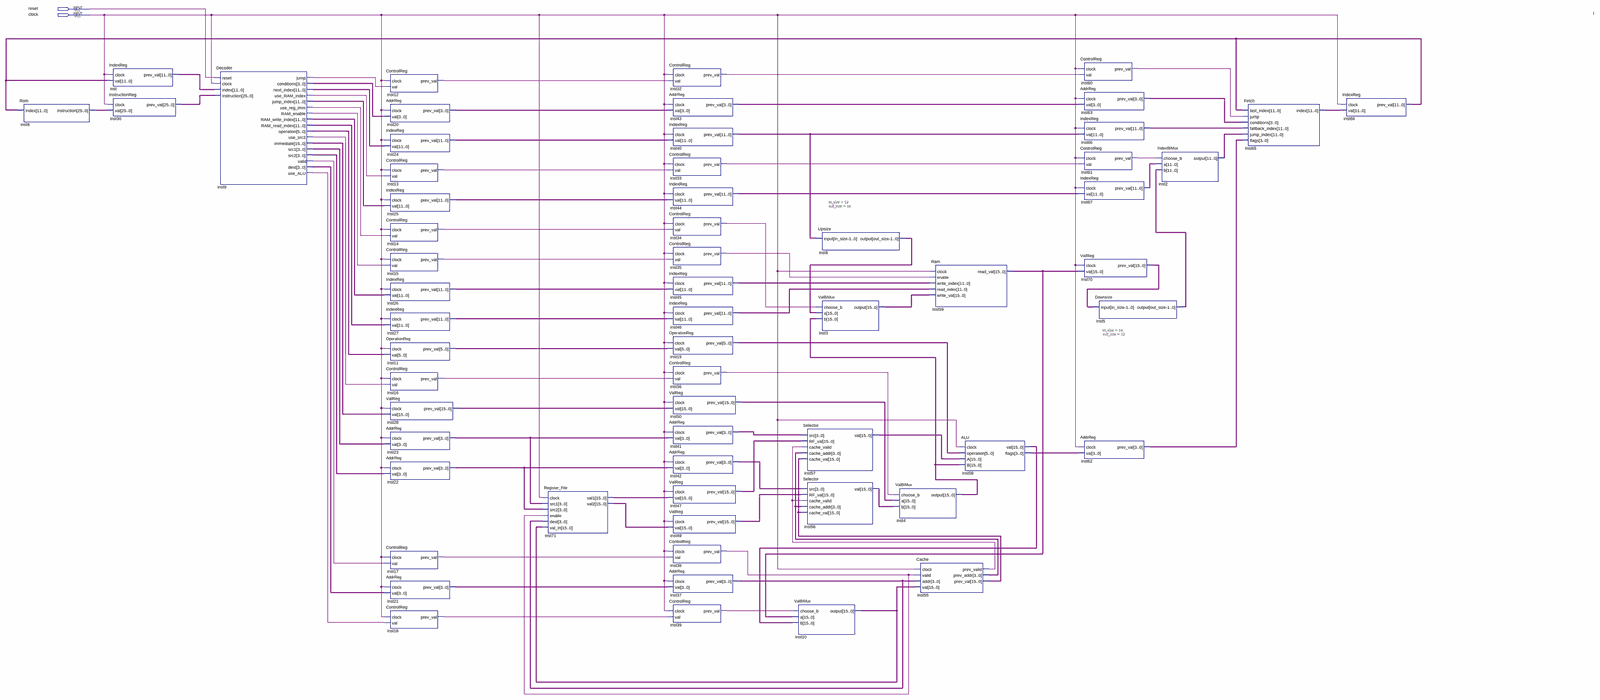
[diagram p0: schematic sheet, whole]
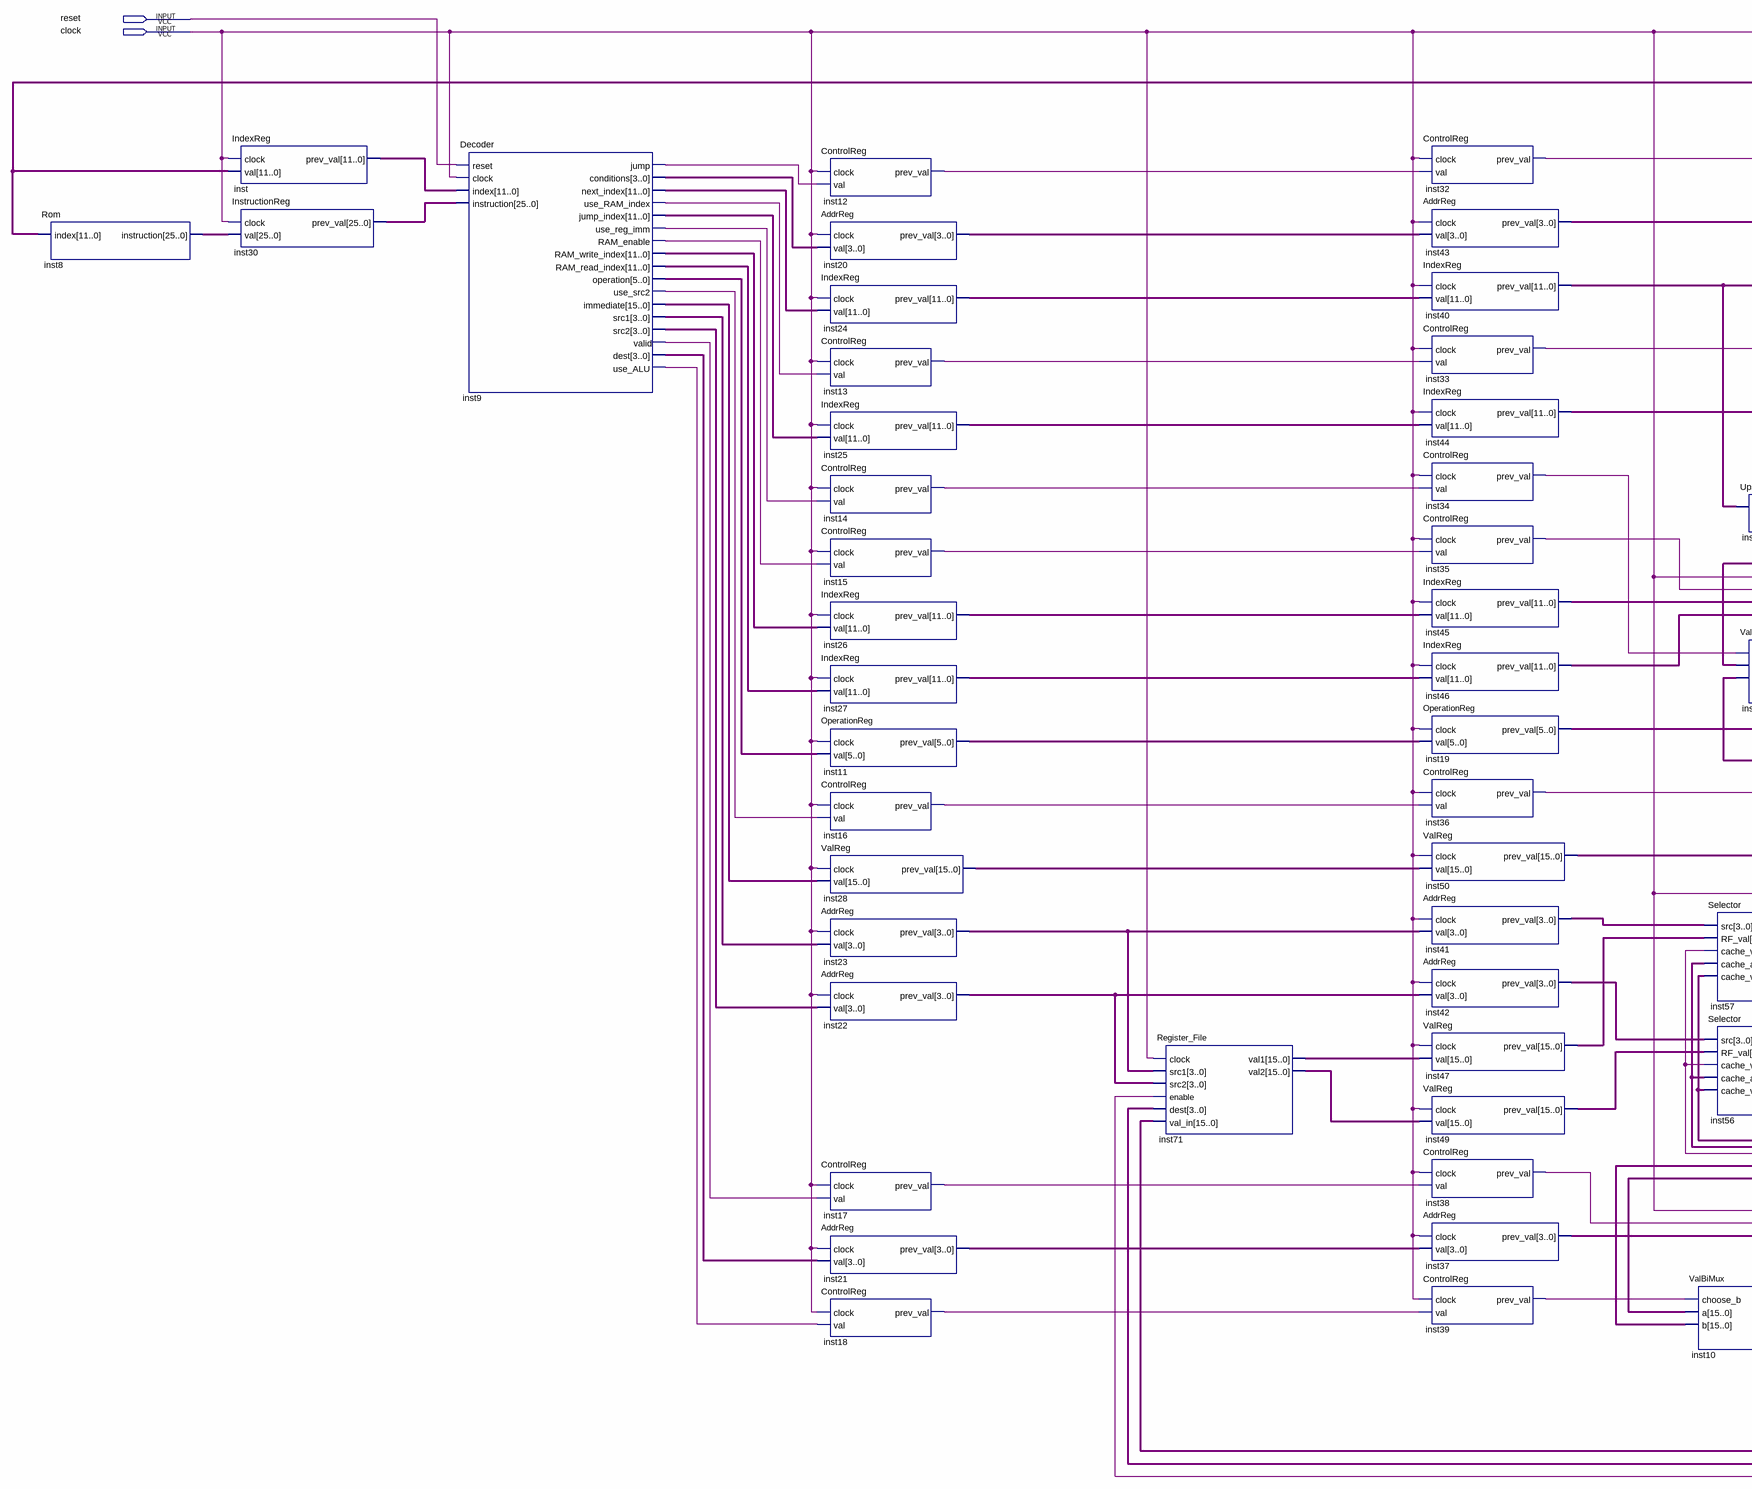
[diagram p1: schematic sheet, left part]
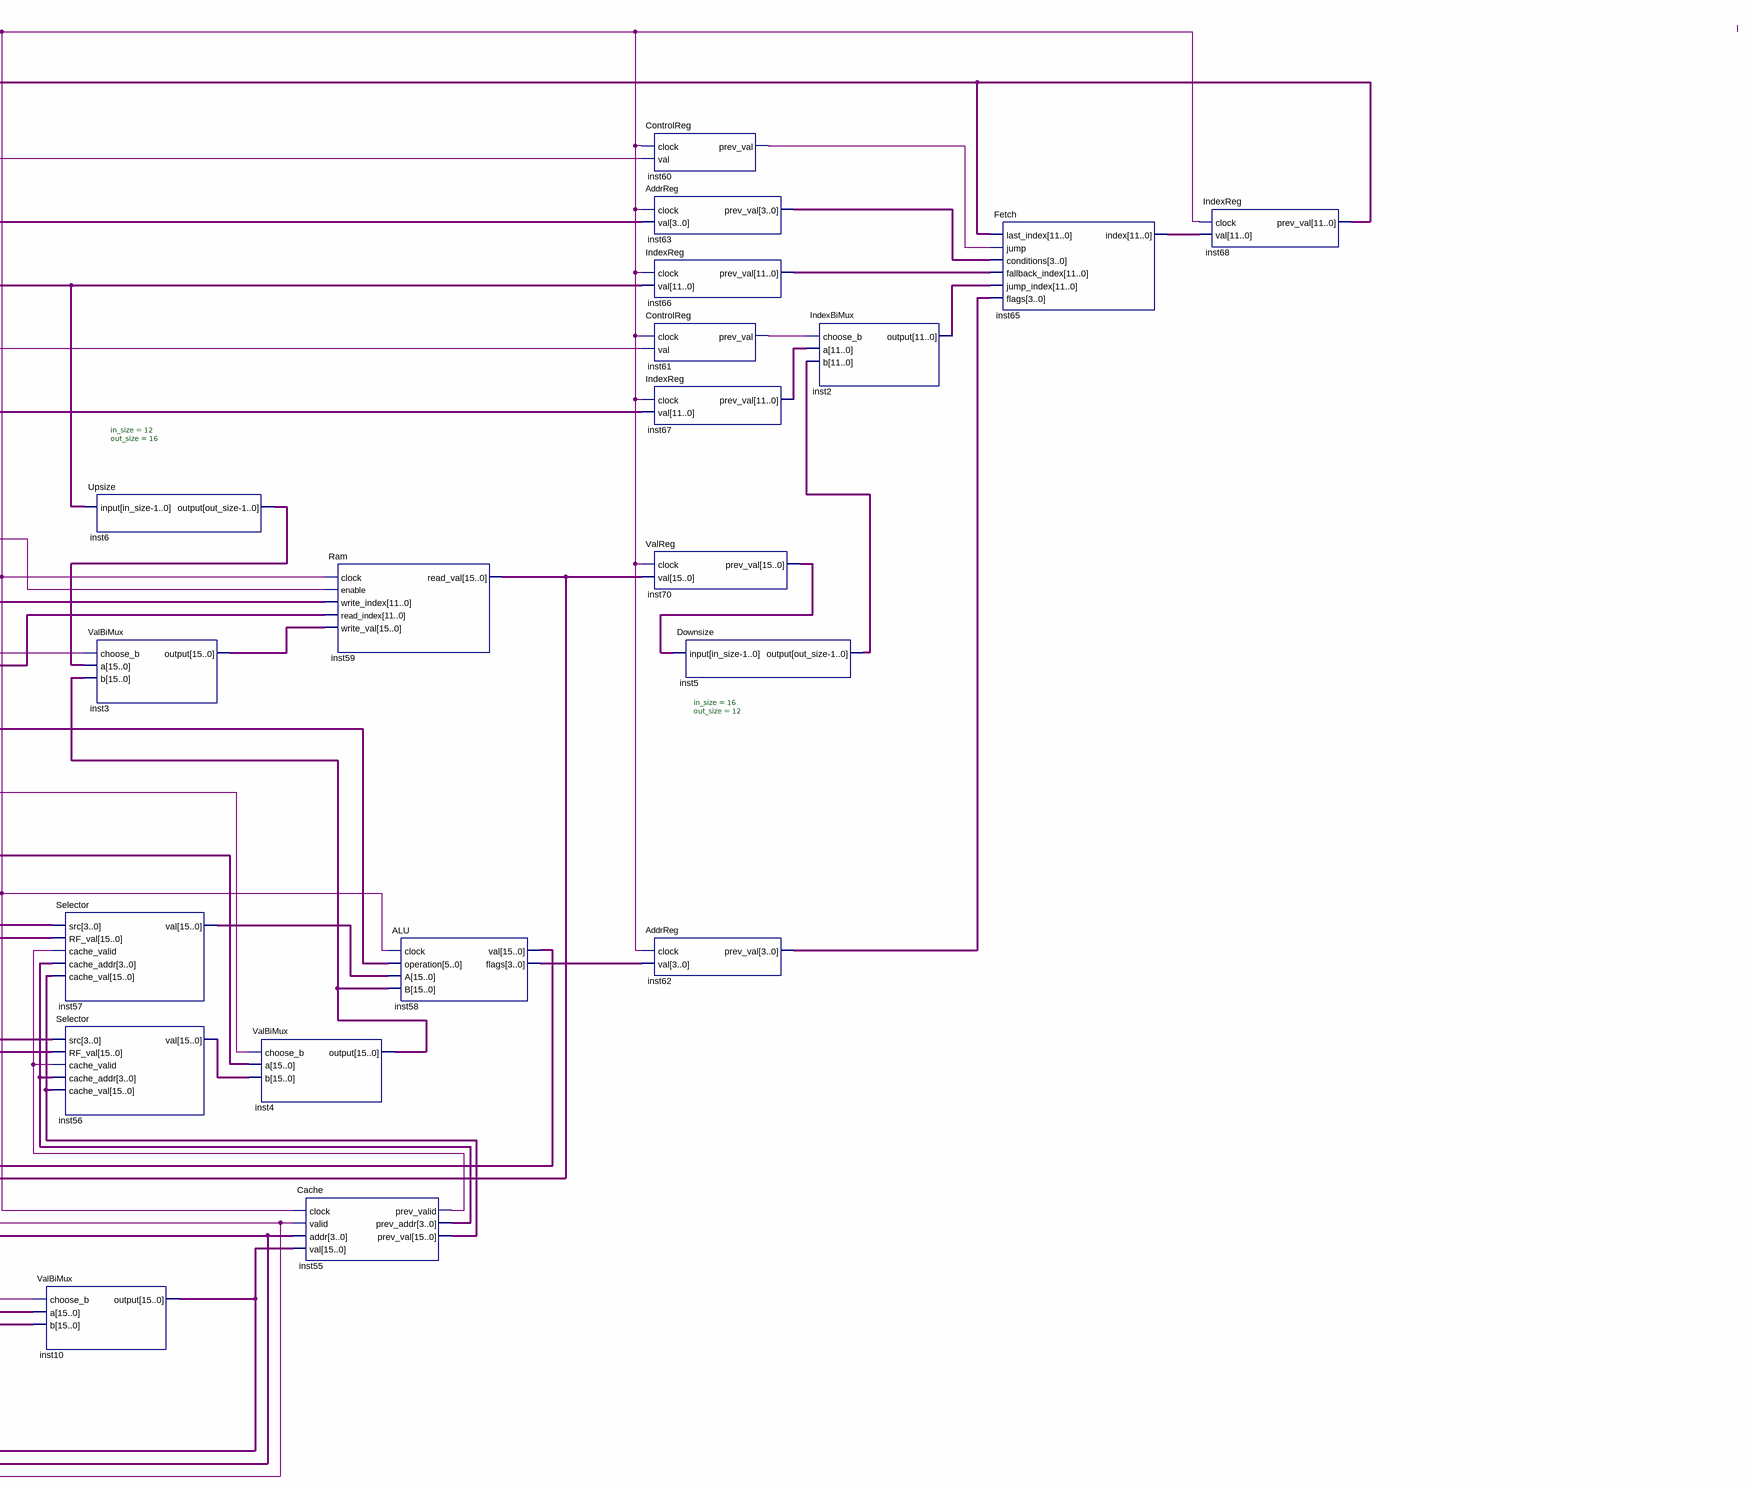
[diagram p2: schematic sheet, right part]
// Quartus schematic CPU.bdf as structural Verilog: 61 symbols, 2 pins
module CPU (
  input  reset,
  input  clock
);

  wire inst9_jump, inst9_ram_enable, inst9_use_alu, inst9_use_ram_index, inst9_use_reg_imm, inst9_use_src2,
       inst9_valid, inst12_prev_val, inst13_prev_val, inst14_prev_val, inst15_prev_val, inst16_prev_val,
       inst17_prev_val, inst18_prev_val, inst32_prev_val, inst33_prev_val, inst34_prev_val, inst35_prev_val,
       inst36_prev_val, inst38_prev_val, inst39_prev_val, inst55_prev_valid, inst60_prev_val, inst61_prev_val;
  wire [3:0] inst9_conditions, inst9_dest, inst9_src1, inst9_src2, inst20_prev_val, inst21_prev_val,
       inst22_prev_val, inst23_prev_val, inst37_prev_val, inst41_prev_val, inst42_prev_val, inst43_prev_val,
       inst55_prev_addr, inst58_flags, inst62_prev_val, inst63_prev_val;
  wire [5:0] inst9_operation, inst11_prev_val, inst19_prev_val;
  wire [11:0] inst2_output, inst5_output, inst9_jump_index, inst9_next_index, inst9_ram_read_index,
       inst9_ram_write_index, inst24_prev_val, inst25_prev_val, inst26_prev_val, inst27_prev_val,
       inst40_prev_val, inst44_prev_val, inst45_prev_val, inst46_prev_val, inst65_index, inst66_prev_val,
       inst67_prev_val, inst68_prev_val, inst_prev_val;
  wire [15:0] inst3_output, inst4_output, inst6_output, inst9_immediate, inst10_output, inst28_prev_val,
       inst47_prev_val, inst49_prev_val, inst50_prev_val, inst55_prev_val, inst56_val, inst57_val,
       inst58_val, inst59_read_val, inst70_prev_val, inst71_val1, inst71_val2;
  wire [25:0] inst8_instruction, inst30_prev_val;

  Rom inst8 (.index(inst68_prev_val), .instruction(inst8_instruction));
  IndexReg inst (.clock(clock), .val(inst68_prev_val), .prev_val(inst_prev_val));
  InstructionReg inst30 (.clock(clock), .val(inst8_instruction), .prev_val(inst30_prev_val));
  Decoder inst9 (
    .reset(reset), .clock(clock), .index(inst_prev_val), .instruction(inst30_prev_val), .jump(inst9_jump),
    .conditions(inst9_conditions), .next_index(inst9_next_index), .use_RAM_index(inst9_use_ram_index),
    .jump_index(inst9_jump_index), .use_reg_imm(inst9_use_reg_imm), .RAM_enable(inst9_ram_enable),
    .RAM_write_index(inst9_ram_write_index), .RAM_read_index(inst9_ram_read_index),
    .operation(inst9_operation), .use_src2(inst9_use_src2), .immediate(inst9_immediate), .src1(inst9_src1),
    .src2(inst9_src2), .valid(inst9_valid), .dest(inst9_dest), .use_ALU(inst9_use_alu));
  ControlReg inst12 (.clock(clock), .val(inst9_jump), .prev_val(inst12_prev_val));
  AddrReg inst20 (.clock(clock), .val(inst9_conditions), .prev_val(inst20_prev_val));
  IndexReg inst24 (.clock(clock), .val(inst9_next_index), .prev_val(inst24_prev_val));
  ControlReg inst13 (.clock(clock), .val(inst9_use_ram_index), .prev_val(inst13_prev_val));
  IndexReg inst25 (.clock(clock), .val(inst9_jump_index), .prev_val(inst25_prev_val));
  ControlReg inst14 (.clock(clock), .val(inst9_use_reg_imm), .prev_val(inst14_prev_val));
  ControlReg inst15 (.clock(clock), .val(inst9_ram_enable), .prev_val(inst15_prev_val));
  IndexReg inst26 (.clock(clock), .val(inst9_ram_write_index), .prev_val(inst26_prev_val));
  IndexReg inst27 (.clock(clock), .val(inst9_ram_read_index), .prev_val(inst27_prev_val));
  OperationReg inst11 (.clock(clock), .val(inst9_operation), .prev_val(inst11_prev_val));
  ControlReg inst16 (.clock(clock), .val(inst9_use_src2), .prev_val(inst16_prev_val));
  ValReg inst28 (.clock(clock), .val(inst9_immediate), .prev_val(inst28_prev_val));
  AddrReg inst23 (.clock(clock), .val(inst9_src1), .prev_val(inst23_prev_val));
  AddrReg inst22 (.clock(clock), .val(inst9_src2), .prev_val(inst22_prev_val));
  ControlReg inst17 (.clock(clock), .val(inst9_valid), .prev_val(inst17_prev_val));
  AddrReg inst21 (.clock(clock), .val(inst9_dest), .prev_val(inst21_prev_val));
  ControlReg inst18 (.clock(clock), .val(inst9_use_alu), .prev_val(inst18_prev_val));
  Register_File inst71 (
    .clock(clock), .src1(inst23_prev_val), .src2(inst22_prev_val), .enable(inst38_prev_val),
    .dest(inst37_prev_val), .val_in(inst10_output), .val1(inst71_val1), .val2(inst71_val2));
  ControlReg inst32 (.clock(clock), .val(inst12_prev_val), .prev_val(inst32_prev_val));
  AddrReg inst43 (.clock(clock), .val(inst20_prev_val), .prev_val(inst43_prev_val));
  IndexReg inst40 (.clock(clock), .val(inst24_prev_val), .prev_val(inst40_prev_val));
  ControlReg inst33 (.clock(clock), .val(inst13_prev_val), .prev_val(inst33_prev_val));
  IndexReg inst44 (.clock(clock), .val(inst25_prev_val), .prev_val(inst44_prev_val));
  ControlReg inst34 (.clock(clock), .val(inst14_prev_val), .prev_val(inst34_prev_val));
  ControlReg inst35 (.clock(clock), .val(inst15_prev_val), .prev_val(inst35_prev_val));
  IndexReg inst45 (.clock(clock), .val(inst26_prev_val), .prev_val(inst45_prev_val));
  IndexReg inst46 (.clock(clock), .val(inst27_prev_val), .prev_val(inst46_prev_val));
  OperationReg inst19 (.clock(clock), .val(inst11_prev_val), .prev_val(inst19_prev_val));
  ControlReg inst36 (.clock(clock), .val(inst16_prev_val), .prev_val(inst36_prev_val));
  ValReg inst50 (.clock(clock), .val(inst28_prev_val), .prev_val(inst50_prev_val));
  AddrReg inst41 (.clock(clock), .val(inst23_prev_val), .prev_val(inst41_prev_val));
  AddrReg inst42 (.clock(clock), .val(inst22_prev_val), .prev_val(inst42_prev_val));
  ValReg inst47 (.clock(clock), .val(inst71_val1), .prev_val(inst47_prev_val));
  ValReg inst49 (.clock(clock), .val(inst71_val2), .prev_val(inst49_prev_val));
  ControlReg inst38 (.clock(clock), .val(inst17_prev_val), .prev_val(inst38_prev_val));
  AddrReg inst37 (.clock(clock), .val(inst21_prev_val), .prev_val(inst37_prev_val));
  ControlReg inst39 (.clock(clock), .val(inst18_prev_val), .prev_val(inst39_prev_val));
  ValBiMux inst10 (.choose_b(inst39_prev_val), .a(inst59_read_val), .b(inst58_val), .\output (inst10_output));
  Upsize #(.in_size(12), .out_size(16)) inst6 (.\input (inst40_prev_val), .\output (inst6_output));
  ValBiMux inst3 (.choose_b(inst34_prev_val), .a(inst6_output), .b(inst4_output), .\output (inst3_output));
  Selector inst57 (
    .src(inst41_prev_val), .RF_val(inst47_prev_val), .cache_valid(inst55_prev_valid),
    .cache_addr(inst55_prev_addr), .cache_val(inst55_prev_val), .val(inst57_val));
  Selector inst56 (
    .src(inst42_prev_val), .RF_val(inst49_prev_val), .cache_valid(inst55_prev_valid),
    .cache_addr(inst55_prev_addr), .cache_val(inst55_prev_val), .val(inst56_val));
  ValBiMux inst4 (.choose_b(inst36_prev_val), .a(inst50_prev_val), .b(inst56_val), .\output (inst4_output));
  Cache inst55 (
    .clock(clock), .valid(inst38_prev_val), .addr(inst37_prev_val), .val(inst10_output),
    .prev_valid(inst55_prev_valid), .prev_addr(inst55_prev_addr), .prev_val(inst55_prev_val));
  Ram inst59 (
    .clock(clock), .enable(inst35_prev_val), .write_index(inst45_prev_val), .read_index(inst46_prev_val),
    .write_val(inst3_output), .read_val(inst59_read_val));
  ALU inst58 (
    .clock(clock), .operation(inst19_prev_val), .A(inst57_val), .B(inst4_output), .val(inst58_val),
    .flags(inst58_flags));
  ControlReg inst60 (.clock(clock), .val(inst32_prev_val), .prev_val(inst60_prev_val));
  AddrReg inst63 (.clock(clock), .val(inst43_prev_val), .prev_val(inst63_prev_val));
  IndexReg inst66 (.clock(clock), .val(inst40_prev_val), .prev_val(inst66_prev_val));
  ControlReg inst61 (.clock(clock), .val(inst33_prev_val), .prev_val(inst61_prev_val));
  IndexReg inst67 (.clock(clock), .val(inst44_prev_val), .prev_val(inst67_prev_val));
  ValReg inst70 (.clock(clock), .val(inst59_read_val), .prev_val(inst70_prev_val));
  AddrReg inst62 (.clock(clock), .val(inst58_flags), .prev_val(inst62_prev_val));
  Downsize #(.in_size(16), .out_size(12)) inst5 (.\input (inst70_prev_val), .\output (inst5_output));
  IndexBiMux inst2 (.choose_b(inst61_prev_val), .a(inst67_prev_val), .b(inst5_output), .\output (inst2_output));
  Fetch inst65 (
    .last_index(inst68_prev_val), .jump(inst60_prev_val), .conditions(inst63_prev_val),
    .fallback_index(inst66_prev_val), .jump_index(inst2_output), .flags(inst62_prev_val), .index(inst65_index));
  IndexReg inst68 (.clock(clock), .val(inst65_index), .prev_val(inst68_prev_val));
endmodule
